# EAGLE design REV1 (EAGLE 7.7.0)
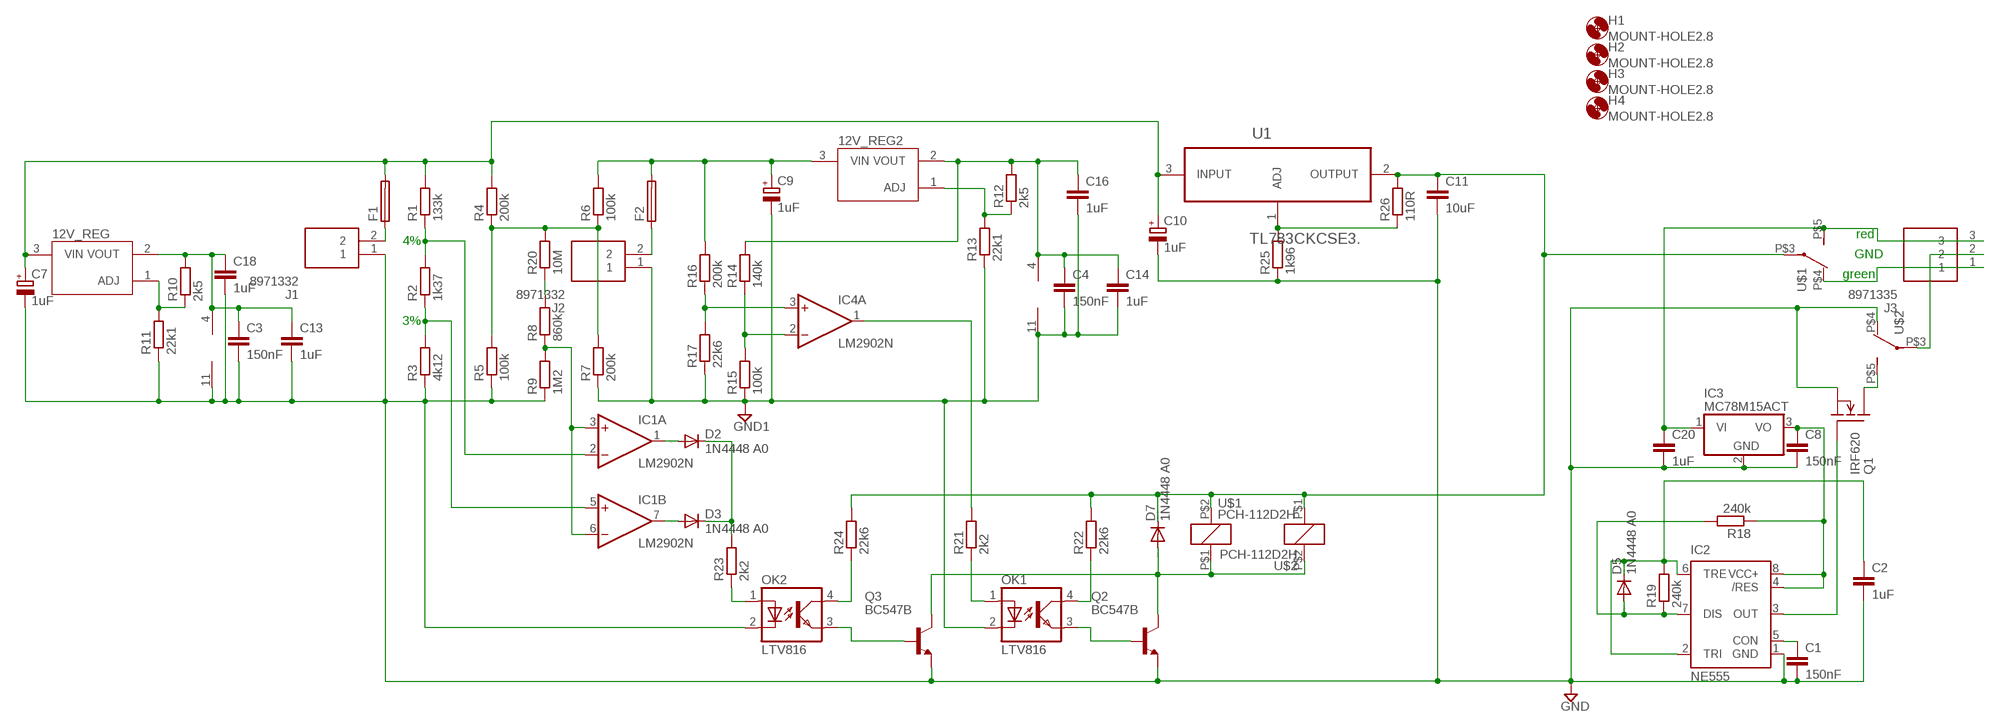
[diagram p0: schematic, sheet 1]

## Parts
12V_REG  LR8LR8  [TO92-LINE]
12V_REG2  LR8LR8  [TO92-LINE]
C1  150nF  C-EU050-024X044  [C050-024X044]
C2  1uF  C-EU025-030X050  [C025-030X050]
C3  150nF  C-EU050-024X044  [C050-024X044]
C4  150nF  C-EU050-024X044  [C050-024X044]
C7  1uF  CPOL-EUE3.5-8  [E3,5-8]
C8  150nF  C-EU050-024X044  [C050-024X044]
C9  1uF  CPOL-EUE3.5-8  [E3,5-8]
C10  1uF  CPOL-EUE3.5-8  [E3,5-8]
C11  10uF  C-EU050-075X075  [C050-075X075]
C13  1uF  C-EU025-030X050  [C025-030X050]
C14  1uF  C-EU025-030X050  [C025-030X050]
C16  1uF  C-EU025-030X050  [C025-030X050]
C18  1uF  C-EU025-030X050  [C025-030X050]
C20  1uF  C-EU025-030X050  [C025-030X050]
D2  1N4448 A0  1N4446  [DO35-10]
D3  1N4448 A0  1N4446  [DO35-10]
D5  1N4448 A0  1N4446  [DO35-10]
D7  1N4448 A0  1N4446  [DO35-10]
F1  GSH15  [GSH15]
F2  GSH15  [GSH15]
H1  MOUNT-HOLE2.8  [2,8]
H2  MOUNT-HOLE2.8  [2,8]
H3  MOUNT-HOLE2.8  [2,8]
H4  MOUNT-HOLE2.8  [2,8]
IC1  LM2902N  [DIL14]
IC2  NE555  [DIL-08]
IC3  MC78M15ACT  [TO220V]
IC4  LM2902N  [DIL14]
J1  8971332  [SHDR2W90P0X350_1X2_700X700X850]
J2  8971332  [SHDR2W90P0X350_1X2_700X700X850]
J3  8971335  [SHDR3W90P0X350_1X3_1050X700X85]
OK1  LTV816  [DIL04]
OK2  LTV816  [DIL04]
Q1  IRF620  [TO220]
Q2  BC547B  [TO92]
Q3  BC547B  [TO92]
R1  133k  R-EU_0207/10  [0207/10]
R2  1k37  R-EU_0207/10  [0207/10]
R3  4k12  R-EU_0207/10  [0207/10]
R4  200k  R-EU_0207/10  [0207/10]
R5  100k  R-EU_0207/10  [0207/10]
R6  100k  R-EU_0207/10  [0207/10]
R7  200k  R-EU_0207/10  [0207/10]
R8  860k  R-EU_0207/10  [0207/10]
R9  1M2  R-EU_0207/10  [0207/10]
R10  2k5  R-EU_0207/10  [0207/10]
R11  22k1  R-EU_0207/10  [0207/10]
R12  2k5  R-EU_0207/10  [0207/10]
R13  22k1  R-EU_0207/10  [0207/10]
R14  140k  R-EU_0207/10  [0207/10]
R15  100k  R-EU_0207/10  [0207/10]
R16  200k  R-EU_0207/10  [0207/10]
R17  22k6  R-EU_0207/10  [0207/10]
R18  240k  R-EU_0207/10  [0207/10]
R19  240k  R-EU_0207/10  [0207/10]
R20  10M  R-EU_0207/10  [0207/10]
R21  2k2  R-EU_0207/10  [0207/10]
R22  22k6  R-EU_0207/10  [0207/10]
R23  2k2  R-EU_0207/10  [0207/10]
R24  22k6  R-EU_0207/10  [0207/10]
R25  1k96  R-EU_0309/10  [0309/10]
R26  110R  R-EU_0309/10  [0309/10]
U1  TL783CKCSE3.  [TO254P457X1016X2222-3P]
U$1  PCH-112D2H  [PCH-112D2H]
U$2  PCH-112D2H  [PCH-112D2H]

## Nets
GND: C1.2 C2.2 C3.2 C7.- C8.2 C10.- C11.2 C13.2 C18.2 C20.2 IC1.11(P:V-) IC2.1(GND) IC3.2(GND) J1.1 OK2.2(C) Q1.3(S) Q2.1(E) Q3.1(E) R3.1 R5.1 R9.1 R11.1 R25.1 U$2.P$4(O)
GND1: C4.2 C9.- C14.2 C16.2 IC4.11(P:V-) J2.1 OK1.2(C) R7.1 R13.1 R15.1 R17.1
N$1: 12V_REG.3(VIN) C7.+ C10.+ F1.2 R1.2 R4.2 U1.3(INPUT)
N$2: IC1.2(A:-IN) R1.1 R2.2
N$3: IC1.5(B:+IN) R2.1 R3.2
N$4: C11.1 D7.C R22.2 R24.2 R26.2 U1.2(OUTPUT) U$1.P$2 U$1.P$3(P) U$2.P$1
N$5: 12V_REG2.3(VIN) C9.+ F2.2 R6.2 R16.2
N$6: IC2.3(OUT) Q1.1(G)
N$7: F1.1 J1.2
N$8: IC4.1(A:OUT) R21.2
N$9: 12V_REG.2(VOUT) C3.1 C13.1 C18.1 IC1.4(P:V+) R10.2
N$10: 12V_REG.1(ADJ) R10.1 R11.2
N$11: D2.A IC1.1(A:OUT)
N$12: D3.A IC1.7(B:OUT)
N$13: D2.C D3.C R23.2
N$14: F2.1 J2.2
N$15: C1.1 IC2.5(CON)
N$16: D5.A IC2.7(DIS) R18.2 R19.1
N$17: C20.1 IC3.1(VI) J3.3 U$1.P$5(S)
N$18: C2.1 D5.C IC2.2(TRI) IC2.6(TRE) R19.2
N$19: C8.1 IC2.4(/RES) IC2.8(VCC+) IC3.3(VO) R18.1
N$20: IC4.3(A:+IN) R16.1 R17.2
N$21: J3.1 U$1.P$4(O)
N$22: 12V_REG2.2(VOUT) C4.1 C14.1 C16.1 IC4.4(P:V+) R12.2 R14.2
N$23: Q1.2(D) U$2.P$5(S)
N$24: IC4.2(A:-IN) R14.1 R15.2
N$25: 12V_REG2.1(ADJ) R12.1 R13.2
N$26: R4.1 R5.2 R6.1 R7.2 R20.2
N$27: IC1.3(A:+IN) IC1.6(B:-IN) R8.1 R9.2
N$28: R8.2 R20.1
N$29: R25.2 R26.1 U1.1(ADJ)
N$31: OK2.1(A) R23.1
N$32: OK2.4(COL) R24.1
N$33: J3.2 U$2.P$3(P)
N$34: D7.A Q2.3(C) Q3.3(C) U$1.P$1 U$2.P$2
N$35: OK2.3(EMIT) Q3.2(B)
N$37: OK1.1(A) R21.1
N$39: OK1.4(COL) R22.1
N$40: OK1.3(EMIT) Q2.2(B)
Unconnected: IC1.8(C:OUT) IC1.9(C:-IN) IC1.10(C:+IN) IC1.12(D:+IN) IC1.13(D:-IN) IC1.14(D:OUT) IC4.5(B:+IN) IC4.6(B:-IN) IC4.7(B:OUT) IC4.8(C:OUT) IC4.9(C:-IN) IC4.10(C:+IN) IC4.12(D:+IN) IC4.13(D:-IN) IC4.14(D:OUT)

## Notes on the sheet
- red
- 4%
- GND
- green
- 3%

## Library data of the parts
12V_REG 12V_REG2 = LR8N3-G:LR8
C1-C4 C8 C11 C13 C14 C16 C18 C20 = rcl:C-EU: CAPACITOR, European symbol; SPICEPREFIX: C
C7 C9 C10 = rcl:CPOL-EU: POLARIZED CAPACITOR, European symbol; SPICEPREFIX: C
D2 D3 D5 D7 = diode:1N4446: DIODE high speed (Philips)
F1 F2 = fuse:GSH15: FUSE HOLDER grid 15mm, 19649 Wickmann; MPN: 64900001039; OC_FARNELL: 1271673; OC_NEWARK: 02P0318
H1-H4 = holes:MOUNT-HOLE: MOUNTING HOLE with drill center marker
IC1 IC4 = linear:LM2902: Low power quad operational amplifier Source: Data sgeet <http://www.st.com/internet/com/TECHNICAL_RESOURCES/TECHNICAL_LITERATURE/DATASHEET/CD00000533.pdf>
IC2 = st-microelectronics:NE555: General purpose bipolar Timer; MF: Arrow Electronics; MPN: NE555N; OC_FARNELL: 1467742; OC_NEWARK: 89K1486
IC3 = linear:MC78M: 500 mA Positive Voltage Regulators Source: Data sheet <http://www.onsemi.com/pub_link/Collateral/MC78M00-D.PDF>
J1 J2 = SamacSys_Parts:8971332: RS Pro 3.5mm Pitch Straight PCB Terminal Block with Screw Termination, PCB Mount, 2 Way Source: Datasheet <http://uk.rs-online.com/web/p/products/8971332>; ARROW_PART_NUMBER: 8971332; ARROW_PRICE/STOCK: http://uk.rs-online.com/web/p/products/8971332; DESCRIPTION: RS Pro 3.5mm Pitch Straight PCB Terminal Block with Screw Termination, PCB Mount, 2 Way; HEIGHT: 8.5mm; MANUFACTURER_NAME: RS Components; MANUFACTURER_PART_NUMBER: 8971332; RS_PART_NUMBER: 8971332; RS_PRICE/STOCK: http://uk.rs-online.com/web/p/products/8971332
J3 = SamacSys_Parts:8971335: 3.5mm U/low prof PCB terminal block,3P Source: Datasheet <http://docs-asia.electrocomponents.com/webdocs/157d/0900766b8157d678.pdf>; DESCRIPTION: 3.5mm U/low prof PCB terminal block,3P; HEIGHT: 8.5mm; MANUFACTURER_NAME: RS Components; MANUFACTURER_PART_NUMBER: 8971335; RS_PART_NUMBER: 8971335
OK1 OK2 = optocoupler:LTV816: OPTO COUPLER Source: LITEON, LTV816.pdf; OC_FARNELL: unknown; OC_NEWARK: unknown
Q1 = transistor-fet:IRF620: N-Channel Enhancement MOSFET (HEXFET); 200V; 5,2A; 0,8Ohm
Q2 Q3 = transistor-npn:BC547*: NPN Transistor
R1-R26 = rcl:R-EU_: RESISTOR, European symbol; SPICEPREFIX: R
U1 = TL783CKCSE3:TL783CKCSE3.: IC,HIGH-VOLTAGE ADJUSTABLE REGULATOR,TO220-3; MPN: TL783CKCSE3.; OC_FARNELL: 1703396; OC_NEWARK: 10M0615; PACKAGE: TO220-3; SUPPLIER: TEXAS INSTRUMENTS
U$1 U$2 = PCH-112D2H:PCH-112D2H

## Board
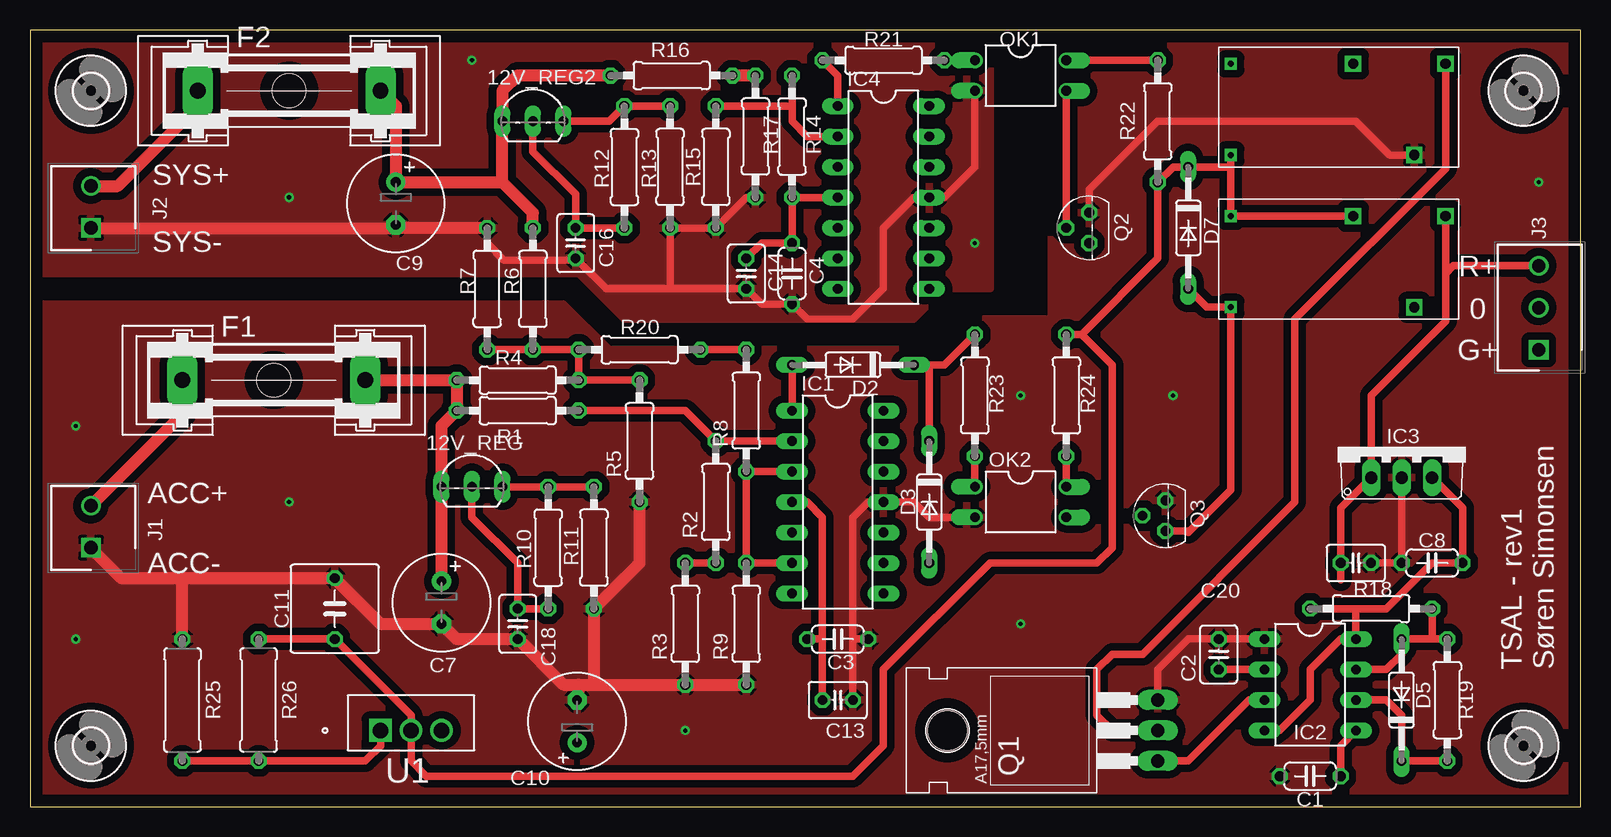
[diagram p1: board, top side]
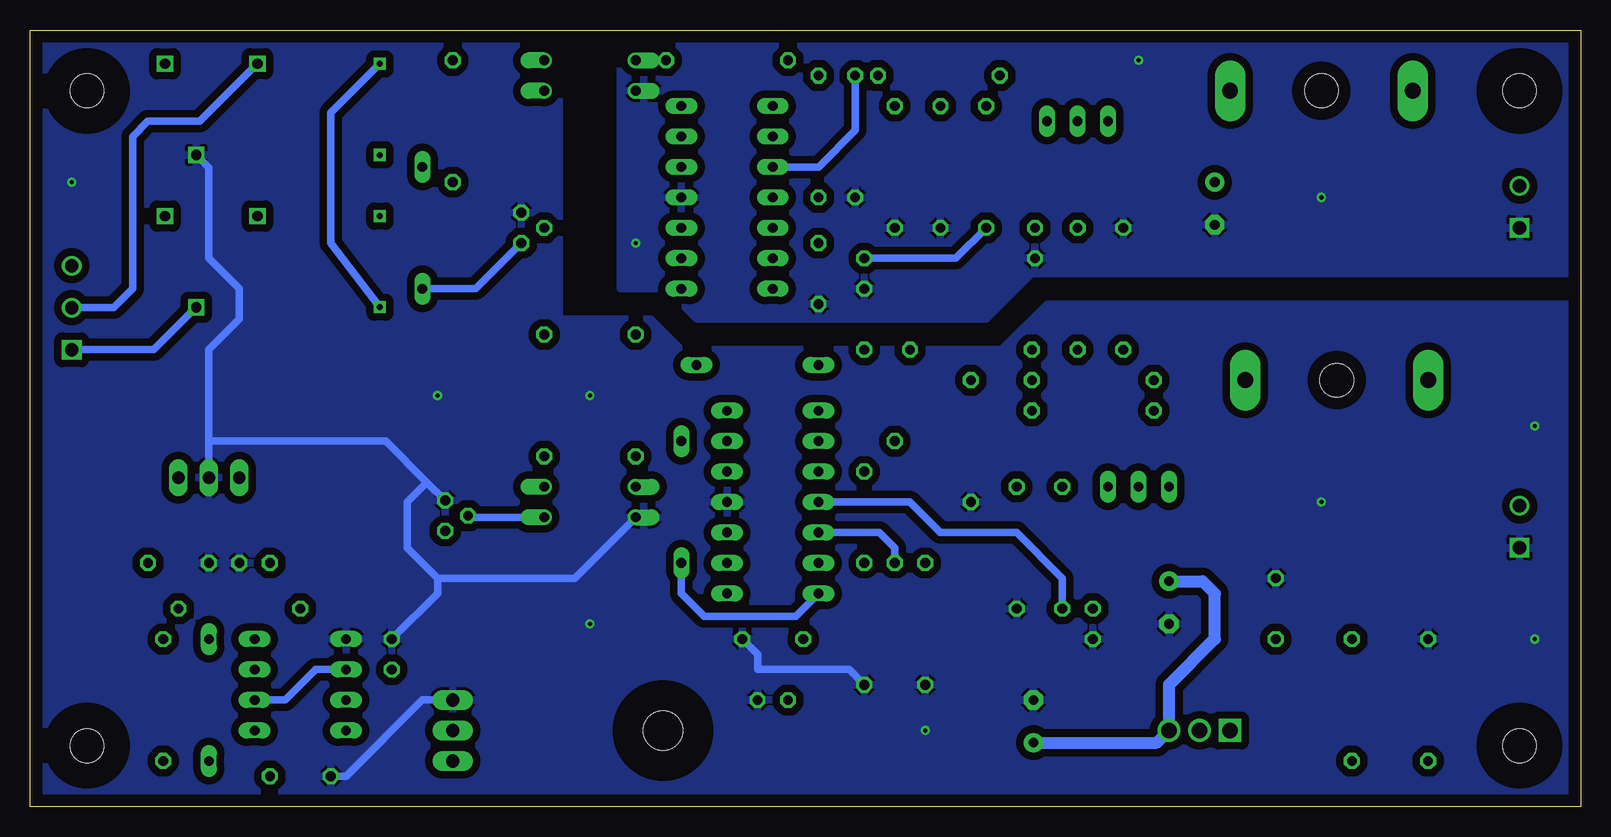
[diagram p2: board, bottom side, seen from below]

Size 129.21 x 64.76 mm. Coordinates in mm from the lower left corner, seen from the top.
Outline: 0,0 129.21,0 129.21,64.76 0,64.76 0,0
Copper layers (1*16): Top 0.035mm / dielectric 1.5mm / Bottom 0.035mm
Design rules "default *": minimum track width 6mil, minimum drill 0.35mm, track to track 25mil, track to pad 25mil, pad to pad 25mil, via to via 25mil, smd to smd 25mil, copper to edge 40mil, drill to drill 6mil, minimum pad ring 10mil, minimum via ring 8mil, stop-mask expansion 4mil, vias tented up to drill 0mil, thermal gap 10mil

### Footprints (pad centres in the part's own frame; a part is rotated, then mirrored left to right if it is on the bottom)
TO92-LINE = drill 0.813 long: 1 2.54,0; 2 0,0; 3 -2.54,0
C050-024X044 = drill 0.813 octagon: 1 -2.54,0; 2 2.54,0
C025-030X050 = drill 0.813 octagon: 1 -1.27,0; 2 1.27,0
E3,5-8 = drill 0.813 pad 1.6: + -1.778,0 | drill 0.813 pad 1.6 octagon: - 1.778,0
C050-075X075 = drill 0.813 octagon: 1 -2.54,0; 2 2.54,0
DO35-10 = drill 0.813 long: A 5.08,0; C -5.08,0
GSH15 = drill 1.321 pad 2.54 long: 1 -7.62,0; 2 7.62,0 | hole 2.794: 0,0
2,8 = hole 2.8: 0,0
DIL14 = drill 0.813 long: 1 -7.62,-3.81; 2 -5.08,-3.81; 3 -2.54,-3.81; 4 0,-3.81; 5 2.54,-3.81; 6 5.08,-3.81; 7 7.62,-3.81; 8 7.62,3.81; 9 5.08,3.81; 10 2.54,3.81; 11 0,3.81; 12 -2.54,3.81; 13 -5.08,3.81; 14 -7.62,3.81
DIL-08 = drill 0.813 long: 1 -3.81,-3.81; 2 -1.27,-3.81; 3 1.27,-3.81; 4 3.81,-3.81; 5 3.81,3.81; 6 1.27,3.81; 7 -1.27,3.81; 8 -3.81,3.81
TO220V = drill 1.016 long: 1 -2.54,-2.54; 2 0,-2.54; 3 2.54,-2.54
SHDR2W90P0X350_1X2_700X700X850 = drill 1.1 pad 1.65 square: 1 0,0 | drill 1.1 pad 1.65: 2 3.5,0
SHDR3W90P0X350_1X3_1050X700X85 = drill 1.1 pad 1.65 square: 1 0,0 | drill 1.1 pad 1.65: 2 3.5,0; 3 7,0
DIL04 = drill 0.813 offset: 1 -1.27,-3.81; 2 1.27,-3.81; 3 1.27,3.81; 4 -1.27,3.81
TO220 = drill 1.118 long: 1 -2.54,-6.35; 2 0,-6.35; 3 2.54,-6.35 | hole 3.302: 0,11.176
TO92 = drill 0.813 octagon: 1 1.27,0; 2 0,1.905; 3 -1.27,0
0207/10 = drill 0.813 octagon: 1 -5.08,0; 2 5.08,0
0309/10 = drill 0.813 octagon: 1 -5.08,0; 2 5.08,0
TO254P457X1016X2222-3P = drill 1.27 square: 1 -5.08,-1.27 | drill 1.27: 2 -2.54,-1.27; 3 0,-1.27
PCH-112D2H = drill 0.5 square: P$1 1,1; P$2 1,8.6 | drill 0.85 square: P$3 11.2,8.6; P$4 16.3,1; P$5 18.9,8.6

### Placement (x,y rotation side)
12V_REG  36.83,26.67 0 top
12V_REG2  41.91,57.15 0 top
C1  106.68,2.54 180 top
C2  99.06,12.7 90 top
C3  67.31,13.97 0 top
C4  63.5,44.45 270 top
C7  34.29,17.02 270 top
C8  116.84,20.32 180 top
C9  30.48,50.29 270 top
C10  45.59,7.11 90 top
C11  25.4,16.51 90 top
C13  67.31,8.89 0 top
C14  59.69,44.45 270 top
C16  45.47,46.99 270 top
C18  40.64,15.24 270 top
C20  110.49,20.32 0 top
D2  68.58,36.83 180 top
D3  74.93,25.4 270 top
D5  114.3,8.89 90 top
D7  96.52,48.26 270 top
F1  20.32,35.56 0 top
F2  21.59,59.69 0 top
H1  124.46,59.69 0 top
H2  124.46,5.08 0 top
H3  5.08,5.08 0 top
H4  5.08,59.69 0 top
IC1  67.31,25.4 270 top
IC2  106.68,10.16 270 top
IC3  114.3,29.97 0 top
IC4  71.12,50.8 270 top
J1  5.08,21.59 90 top
J2  5.08,48.26 90 top
J3  125.73,38.1 90 top
OK1  82.55,60.96 270 top
OK2  82.55,25.4 270 top
Q1  87.63,6.35 90 top
Q2  88.27,48.26 90 top
Q3  94.61,24.26 90 top
R1  40.64,33.02 180 top
R2  57.15,25.4 90 top
R3  54.61,15.24 90 top
R4  40.64,35.56 180 top
R5  50.8,30.48 90 top
R6  41.91,43.18 90 top
R7  38.1,43.18 270 top
R8  59.69,33.02 90 top
R9  59.69,15.24 90 top
R10  43.18,21.59 270 top
R11  46.99,21.59 90 top
R12  49.53,53.34 270 top
R13  53.34,53.34 90 top
R14  63.5,55.88 270 top
R15  57.15,53.34 90 top
R16  53.47,60.96 180 top
R17  60.45,55.88 90 top
R18  111.76,16.51 0 top
R19  118.11,8.89 270 top
R20  50.8,38.1 180 top
R21  71.12,62.23 180 top
R22  93.98,57.15 270 top
R23  78.74,34.29 90 top
R24  86.36,34.29 90 top
R25  12.7,8.89 270 top
R26  19.05,8.89 90 top
U1  34.29,7.62 0 top
U$1  99.06,40.64 0 top
U$2  99.06,53.34 0 top

### Tracks (layer width: path | path; a pad name or v marks a point on that pad's centre or on a via)
GND  (via drill 0.35)
  Top 0.61: IC2.1 C2.2 96.52,13.97 93.98,11.43 Q1.3 | C20.2 C8.2 IC3.2 | 68.58,13.97 68.58,24.13 69.85,25.4 IC1.11 73.66,25.4 74.93,24.13 OK2.2 | 68.58,13.97 C13.2 | C3.2 68.58,13.97 | Q2.1 88.27,51.44 93.98,57.15 110.49,57.15 113.3,54.34 U$2.P$4
  Top 1.016: 12.7,19.05 C11.2 29.21,15.24 C7.- 35.56,13.97 C18.2 44.45,10.16 45.72,10.16 | 12.7,19.05 7.62,19.05 J1.1 | R25.1 12.7,19.05 | 45.72,10.16 46.99,10.16 | 46.99,10.16 R3.1 R9.1 | C10.- 45.72,9.02 45.72,10.16 | 46.99,10.16 R11.1 50.8,20.32 R5.1
  Bottom 0.61: R9.1 60.96,11.43 68.58,11.43 68.58,12.7 C3.2 | C1.2 102.87,2.54 96.52,8.89 Q1.3 | U$2.P$4 114.3,53.28 114.3,45.72 111.76,43.18 111.76,40.64 114.3,38.1 114.3,30.48 | 114.3,30.48 IC3.2 | Q3.1 96.14,27.05 | 96.14,27.05 99.57,30.48 114.3,30.48 | OK2.2 83.82,19.05 95.25,19.05 | 95.25,19.05 97.79,21.59 97.79,25.4 96.14,27.05 | C2.2 95.25,17.78 95.25,19.05
  other vias: 3.81,31.75 3.81,13.97 21.59,25.4 54.61,6.35 82.55,15.24 82.55,34.29 95.25,34.29 125.73,52.07
  pour Top: 0,0 129.54,0 129.54,64.77 85.09,64.77 85.09,40.64 77.47,40.64 74.93,38.1 48.26,38.1 44.45,41.91 0,41.91
  pour Bottom: 0,41.91 0,0 129.54,0 129.54,64.77 85.09,64.77 85.09,40.64 77.47,40.64 74.93,38.1 48.26,38.1 44.45,41.91
GND1  (via drill 0.35)
  Top 0.61: R17.1 59.69,50.8 R15.1 R13.1 53.34,43.18 | OK1.2 78.74,53.34 76.2,50.8 IC4.11 73.66,50.8 71.12,48.26 71.12,43.18 68.58,40.64 64.77,40.64 C4.2 60.96,41.91 C14.2 53.34,43.18 | 53.34,43.18 48.01,43.18 45.59,45.59 | 45.59,45.59 C16.2 | 30.35,48.39 C9.- | R7.1 38.1,46.99 39.5,45.59 45.59,45.59
  Top 1.016: J2.1 30.23,48.26 | 30.23,48.26 30.35,48.39 | R7.1 30.23,48.26
  other vias: 21.59,50.8 36.83,62.23 78.74,46.99
  pour Bottom: 0,44.45 45.72,44.45 49.53,40.64 73.66,40.64 76.2,43.18 80.01,43.18 80.01,64.77 0,64.77
  pour Top: 0,64.77 80.01,64.77 80.01,43.18 76.2,43.18 73.66,40.64 49.53,40.64 45.72,44.45 0,44.45
N$1
  Top 1.016: F1.2 R4.2 R1.2 34.29,31.75 12V_REG.3 C7.+
  Bottom 1.016: C7.+ 31.5,18.8 30.48,17.78 30.48,13.97 34.29,10.16 U1.3 35.31,5.33 C10.+
N$2
  Top 0.61: IC1.2 R2.2 54.61,33.02 R1.1
N$3
  Top 0.61: R3.2 R2.1
  Bottom 0.61: IC1.5 58.42,22.86 57.15,21.59 R2.1
N$4
  Top 0.61: U$2.P$1 100.06,53.34 | 100.06,53.34 U$1.P$2 U$1.P$3 | 100.06,53.34 D7.C 95.25,53.34 R22.2 93.98,45.72 87.63,39.37 | 31.75,5.69 U1.2 | 87.63,39.37 R24.2 | U1.2 31.75,3.81 33.02,2.54 68.58,2.54 71.12,5.08 71.12,11.43 80.01,20.32 88.9,20.32 90.17,21.59 90.17,36.83 87.63,39.37 | R26.2 C11.1 31.75,7.62 U1.2
N$5
  Top 1.016: F2.2 30.48,58.42 C9.+ 39.37,52.07 | R6.2 41.91,49.53 39.37,52.07 | 39.37,52.07 12V_REG2.3 39.37,59.69 40.64,60.96 R16.2
N$6
  Top 0.61: Q1.1 96.52,3.81 101.6,8.89 IC2.3
N$7
  Top 1.016: J1.2 12.7,32.71 F1.1
N$8
  Top 0.61: IC4.1 67.31,60.96 R21.2
N$9
  Top 0.61: R10.2 C18.1 40.64,20.32 36.83,24.13 12V_REG.2 | C13.1 66.04,13.97 | 66.04,13.97 66.04,24.13 64.77,25.4 IC1.4 | C3.1 66.04,13.97
  Bottom 0.61: IC1.4 55.88,25.4 53.34,22.86 46.99,22.86 43.18,19.05 R10.2
N$10
  Top 0.61: R11.2 R10.1 12V_REG.1
N$11
  Top 0.61: D2.A IC1.1
N$12
  Bottom 0.61: IC1.7 65.41,15.88 73.03,15.88 74.93,17.78 D3.A
N$13
  Top 0.61: D3.C 74.93,36.83 D2.C 76.2,36.83 R23.2
N$14
  Top 1.016: J2.2 7.31,51.76 13.97,58.42 F2.1
N$15
  Top 0.61: IC2.5 109.22,5.08 C1.1
N$16
  Top 0.61: 116.84,13.97 D5.A 114.3,12.7 113.03,11.43 IC2.7 | 116.84,13.97 R19.1 | R18.2 116.84,13.97
N$17
  Top 0.61: 109.22,18.91 C20.1 109.22,24.89 IC3.1 111.76,34.29 117.96,40.49 117.96,44.45 | U$1.P$5 117.96,44.45 | J3.3 118.61,45.1 117.96,44.45
N$18
  Top 0.61: C2.1 IC2.2 | IC2.6 113.03,8.89 114.3,7.62 D5.C R19.2
  Bottom 0.61: IC2.6 107.95,8.89 105.41,11.43 IC2.2
N$19
  Top 0.61: IC2.4 104.14,6.35 106.68,8.89 106.68,11.43 109.22,13.97 IC2.8 110.49,16.51 | IC3.3 119.38,24.89 C8.1 116.84,20.32 113.03,16.51 110.49,16.51 | R18.1 110.49,16.51
N$20
  Top 1.016: R17.2 R16.1
  Bottom 0.61: IC4.3 63.5,53.34 60.45,56.39 R17.2
N$21
  Bottom 0.61: J3.1 118.9,38.1 U$1.P$4
N$22
  Top 0.61: IC4.4 R14.2 C4.1 60.96,46.99 C14.1 | 12V_REG2.2 41.91,54.61 45.47,51.05 C16.1 R12.2
  Bottom 0.61: R12.2 52.07,45.72 C14.1
N$23
  Top 0.61: U$2.P$5 117.96,53.19 105.41,40.64 105.41,25.4 92.71,12.7 90.17,12.7 88.9,11.43 88.9,7.62 90.17,6.35 Q1.2 92.71,6.35
N$24
  Top 0.61: R14.1 63.5,58.42 | 63.5,58.42 63.5,57.15 64.77,55.88 IC4.2 | R15.2 63.5,58.42
N$25
  Top 0.61: 12V_REG2.1 48.26,57.15 R12.1 R13.2
N$26
  Top 0.61: R5.2 R4.1 R20.2 R6.1 R7.2
N$27
  Top 0.61: IC1.3 R8.1 R9.2 IC1.6
N$28
  Top 0.61: R20.1 R8.2
N$29
  Top 0.61: R25.2 R26.1 27.94,3.81 29.21,5.08 U1.1
N$31
  Top 0.61: R23.1 OK2.1
N$32
  Top 0.61: R24.1 OK2.4
N$33
  Bottom 0.61: U$2.P$3 115.05,57.15 119.38,57.15 120.65,55.88 120.65,43.18 122.23,41.6 J3.2
N$34
  Top 0.61: Q3.3 96.39,22.99 96.52,22.86 100.06,26.4 U$1.P$1 98.06,41.64 D7.A
  Bottom 0.61: Q2.3 92.08,43.18 D7.A | U$2.P$2 104.14,57.86 104.14,46.99 U$1.P$1
N$35
  Bottom 0.61: Q3.2 92.58,24.13 OK2.3
N$37
  Top 0.61: OK1.1 R21.1
N$39
  Top 0.61: OK1.4 R22.1
N$40
  Top 0.61: OK1.3 Q2.2

### Text on the board
tPlace: SYS+ | SYS- | R+ | 0 | G+ | ACC+ | ACC- | TSAL - rev1 / Søren Simonsen